# EAGLE design Reef Controller rev2 (EAGLE 7.4.0)
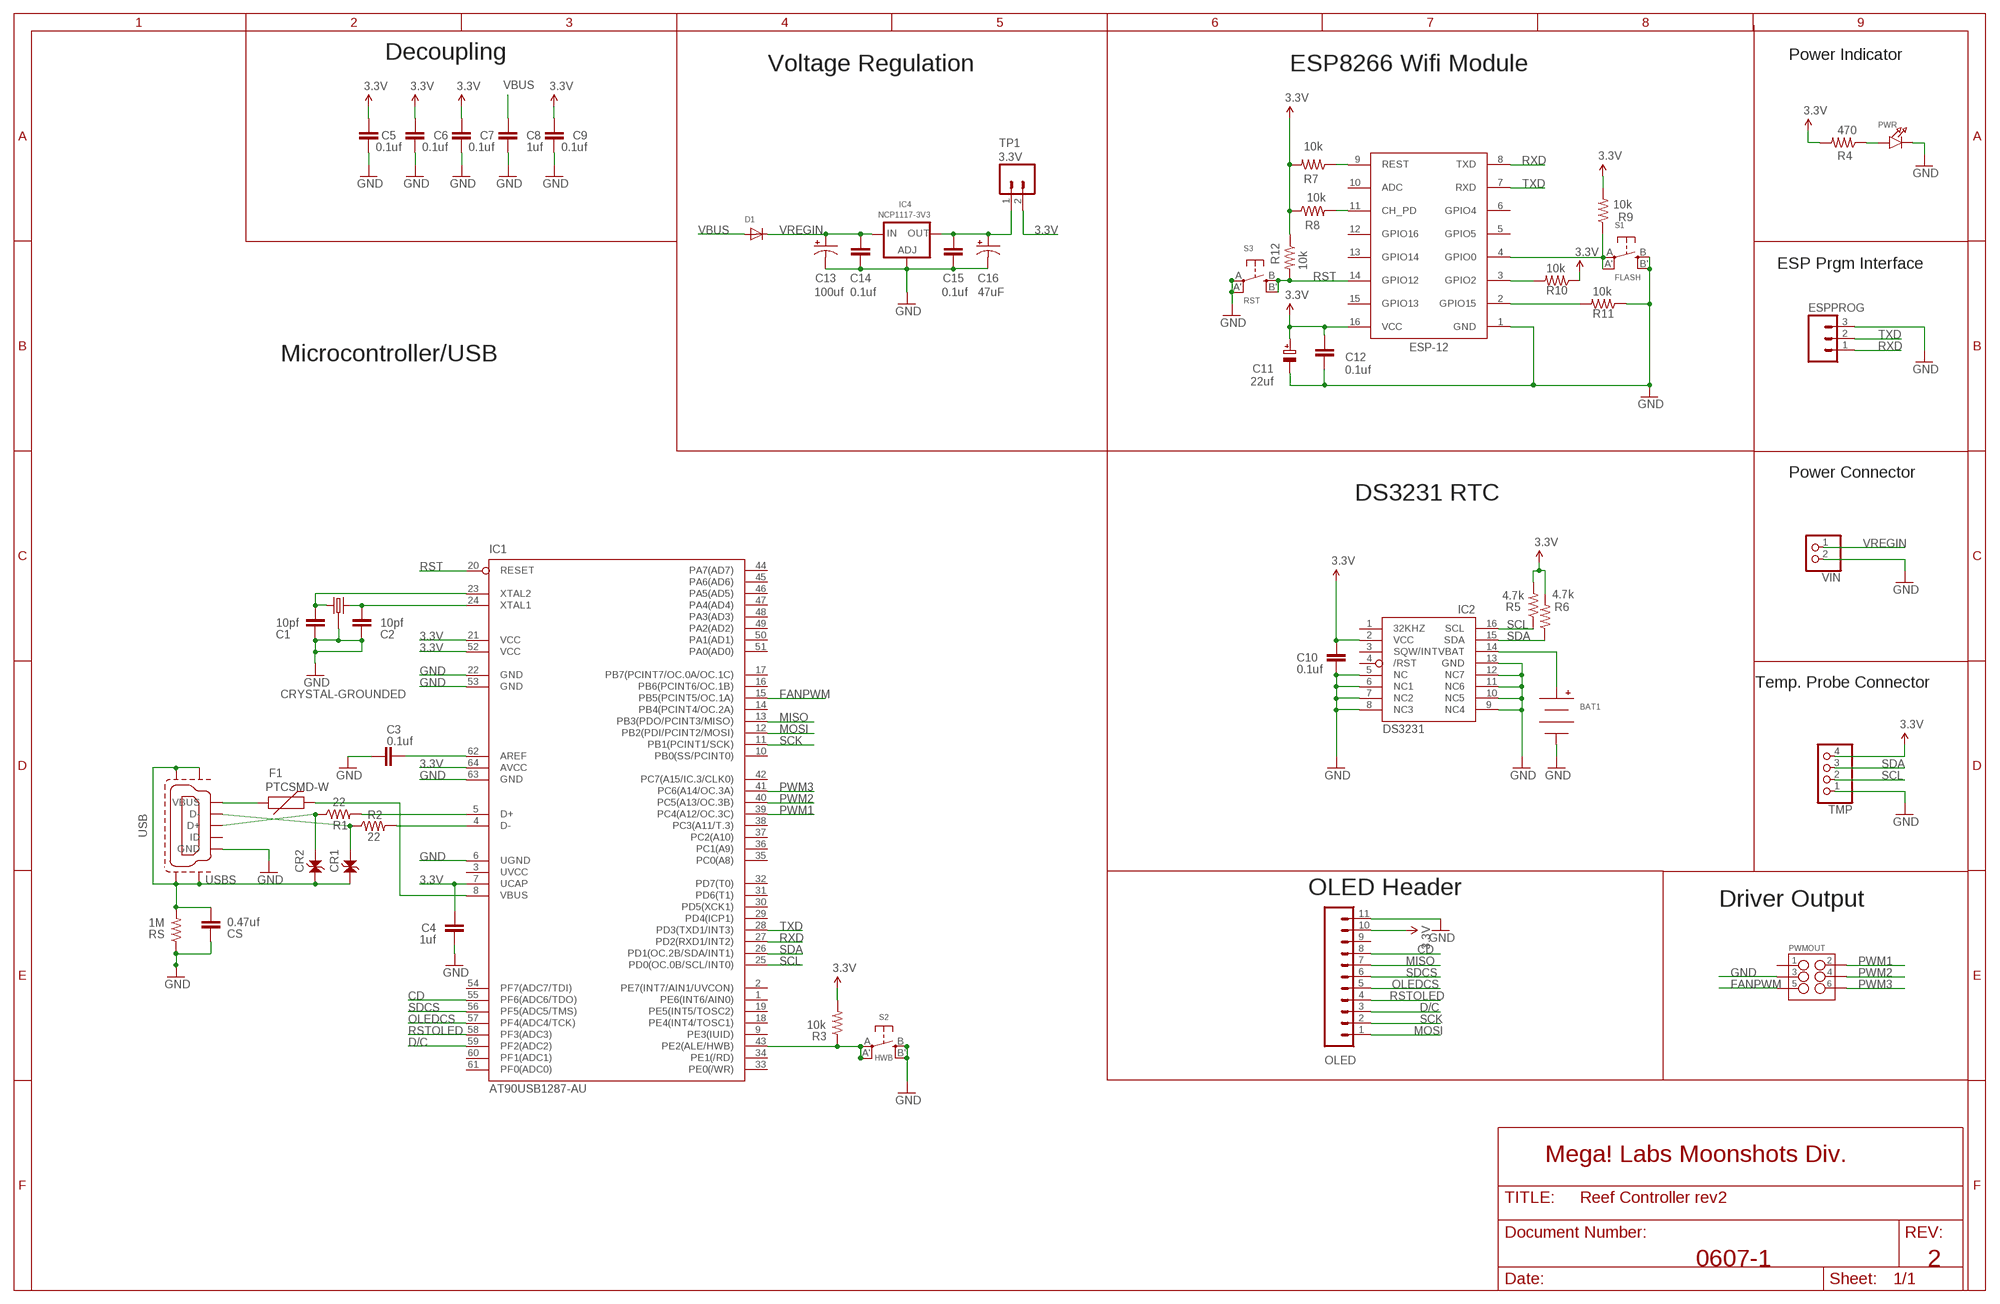
[diagram p0: schematic, sheet 1]

## Parts
BAT1  BHX1-2032-SM  [BHX1-2032-SM]
C1  10pf  CAP0805  [0805]
C2  10pf  CAP0805  [0805]
C3  0.1uf  CAP0805  [0805]
C4  1uf  CAP0805  [0805]
C5  0.1uf  CAP0805  [0805]
C6  0.1uf  CAP0805  [0805]
C7  0.1uf  CAP0805  [0805]
C8  1uf  CAP0805  [0805]
C9  0.1uf  CAP0805  [0805]
C10  0.1uf  CAP0805  [0805]
C11  22uf  CAP_TANTALUMA/3216_REFLOW  [EIA3216-18/A-R]
C12  0.1uf  CAP0805  [0805]
C13  100uf  47UF-50V-20%(ELECT)  [PANASONIC_D]
C14  0.1uf  CAP0805  [0805]
C15  0.1uf  CAP0805  [0805]
C16  47uF  47UF-10V-10%(TANT)  [EIA3528]
CR1  PGB1010603  [PGB1010603]
CR2  PGB1010603  [PGB1010603]
CS  0.47uf  CAP0805  [0805]
D1  DIODESOD-323F  [SOD-323F]
ESPPROG  M03PTH  [1X03]
F1  PTCSMD-W  [PTC-1206-WIDE]
IC1  AT90USB1287-AU  [TQFP64]
IC2  DS3231/SO  [SO16W]
IC3  ESP-12  [ESP-12]
IC4  NCP1117-3V3  LM1117TO252  [TO252]
OLED  M11PTH  [1X11]
PWMOUT  M03X2SHROUD  [2X3-SHROUDED]
PWR  LED0805_NOOUTLINE  [CHIPLED_0805_NOOUTLINE]
R1  22  RESISTOR0805-RES  [0805]
R2  22  RESISTOR0805-RES  [0805]
R3  10k  RESISTOR0805-RES  [0805]
R4  470  RESISTOR0805-RES  [0805]
R5  4.7k  RESISTOR0805-RES  [0805]
R6  4.7k  RESISTOR0805-RES  [0805]
R7  10k  RESISTOR0805-RES  [0805]
R8  10k  RESISTOR0805-RES  [0805]
R9  10k  RESISTOR0805-RES  [0805]
R10  10k  RESISTOR0805-RES  [0805]
R11  10k  RESISTOR0805-RES  [0805]
R12  10k  RESISTOR0805-RES  [0805]
RS  1M  RESISTOR0805-RES  [0805]
S1  FLASH  SWITCH_TACT_SMT4.6X2.8  [BTN_KMR2_4.6X2.8]
S2  HWB  SWITCH_TACT_SMT4.6X2.8  [BTN_KMR2_4.6X2.8]
S3  RST  SWITCH_TACT_SMT4.6X2.8  [BTN_KMR2_4.6X2.8]
TMP  JST_4PIN  [JSTPH4]
TP1  3.3V  M02PTH  [1X02]
USB  MINI-USB-SHIELD-UX60-MB-5ST  [UX60-MB-5ST]
VIN  JST_2PIN-SMT-RA  [JST-PH-2-SMT-RA]
X1  CRYSTAL-GROUNDED  [CRYSTAL-SMD-5X3]

## Nets
3.3V: C4.2 C5.1 C6.1 C7.1 C9.1 C10.1 C11.+ C12.2 IC1.7(UCAP) IC1.21(VCC) IC1.52(VCC) IC1.64(AVCC) IC2.2(VCC) IC3.16(VCC) OLED.10 R3.2 R4.2 R5.2 R6.2 R7.2 R8.1 R9.2 R10.1 R12.1 TMP.4 TP1.2
CD: IC1.55(PF6(ADC6/TDO)) OLED.8
D/C: IC1.59(PF2(ADC2)) OLED.3
D_N [usb]: CR1.2 R2.1 USB.D-
D_N2 [usb2]: IC1.4(D-) R2.2
D_P [usb]: CR2.2 R1.1 USB.D+
D_P2 [usb2]: IC1.5(D+) R1.2
FANPWM: IC1.15(PB5(PCINT5/OC.1A)) PWMOUT.5
GND: BAT1.2(NEG) C1.2 C2.2 C3.1 C4.1 C5.2 C6.2 C7.2 C8.2 C9.2 C10.2 C11.- C12.1 C13.- C14.2 C15.2 C16.C(-) CS.1 ESPPROG.3 IC1.6(UGND) IC1.22(GND) IC1.53(GND) IC1.63(GND) IC2.5(NC) IC2.6(NC1) IC2.7(NC2) IC2.8(NC3) IC2.9(NC4) IC2.10(NC5) IC2.11(NC6) IC2.12(NC7) IC2.13(GND) IC3.1(GND) IC4.1(ADJ) OLED.11 PWMOUT.3 PWR.C R11.1 RS.1 S1.B'(S1) S1.B(S) S2.B'(S1) S2.B(S) S3.A'(P1) S3.A(P) TMP.1 USB.GND VIN.2 X1.2 X1.4
MISO: IC1.13(PB3(PDO/PCINT3/MISO)) OLED.7
MOSI: IC1.12(PB2(PDI/PCINT2/MOSI)) OLED.1
N$2: IC1.43(PE2(ALE/HWB)) R3.1 S2.A'(P1) S2.A(P)
N$3: IC3.3(GPIO2) R10.2
N$4: IC3.4(GPIO0) R9.1 S1.A'(P1) S1.A(P)
N$6: CR1.1 CR2.1 CS.2 RS.2 USB.M1(M3) USB.M2 USB.M3(M4) USB.M4(M1)
N$8: PWR.A R4.1
N$9: BAT1.1(POS) IC2.14(VBAT)
N$10: C3.2 IC1.62(AREF)
N$11: IC3.11(CH_PD) R8.2
N$12: F1.1 USB.VBUS
N$14: IC3.2(GPIO15) R11.2
N$17: IC3.9(REST) R7.1
N$21: C15.1 C16.A(+) IC4.3(OUT) TP1.1
OLEDCS: IC1.57(PF4(ADC4/TCK)) OLED.5
PWM1: IC1.39(PC4(A12/OC.3C)) PWMOUT.2
PWM2: IC1.40(PC5(A13/OC.3B)) PWMOUT.4
PWM3: IC1.41(PC6(A14/OC.3A)) PWMOUT.6
RST: IC1.20(RESET) IC3.14(GPIO12) R12.2 S3.B'(S1) S3.B(S)
RSTOLED: IC1.58(PF3(ADC3)) OLED.4
RXD: ESPPROG.1 IC1.27(PD2(RXD1/INT2)) IC3.8(TXD)
SCK: IC1.11(PB1(PCINT1/SCK)) OLED.2
SCL: IC1.25(PD0(OC.0B/SCL/INT0)) IC2.16(SCL) R5.1 TMP.2
SDA: IC1.26(PD1(OC.2B/SDA/INT1)) IC2.15(SDA) R6.1 TMP.3
SDCS: IC1.56(PF5(ADC5/TMS)) OLED.6
TXD: ESPPROG.2 IC1.28(PD3(TXD1/INT3)) IC3.7(RXD)
VBUS: C8.1 D1.A F1.2 IC1.8(VBUS)
VREGIN: C13.+ C14.1 D1.C IC4.2(IN) VIN.1
XTAL_N [xtal]: C1.1 IC1.23(XTAL2) X1.3
XTAL_P [xtal]: C2.1 IC1.24(XTAL1) X1.1
Unconnected: IC1.1(PE6(INT6/AIN0)) IC1.2(PE7(INT7/AIN1/UVCON)) IC1.9(PE3(IUID)) IC1.10(PB0(SS/PCINT0)) IC1.14(PB4(PCINT4/OC.2A)) IC1.16(PB6(PCINT6/OC.1B)) IC1.17(PB7(PCINT7/OC.0A/OC.1C)) IC1.18(PE4(INT4/TOSC1)) IC1.19(PE5(INT5/TOSC2)) IC1.29(PD4(ICP1)) IC1.30(PD5(XCK1)) IC1.31(PD6(T1)) IC1.32(PD7(T0)) IC1.33(PE0(/WR)) IC1.34(PE1(/RD)) IC1.35(PC0(A8)) IC1.36(PC1(A9)) IC1.37(PC2(A10)) IC1.38(PC3(A11/T.3)) IC1.42(PC7(A15/IC.3/CLK0)) IC1.44(PA7(AD7)) IC1.45(PA6(AD6)) IC1.46(PA5(AD5)) IC1.47(PA4(AD4)) IC1.48(PA3(AD3)) IC1.49(PA2(AD2)) IC1.50(PA1(AD1)) IC1.51(PA0(AD0)) IC1.54(PF7(ADC7/TDI)) IC1.60(PF1(ADC1)) IC1.61(PF0(ADC0)) IC2.1(32KHZ) IC2.3(SQW/INT) IC2.4(/RST) IC3.5(GPIO5) IC3.6(GPIO4) IC3.10(ADC) IC3.12(GPIO16) IC3.13(GPIO14) IC3.15(GPIO13) OLED.9 PWMOUT.1 USB.ID

## Notes on the sheet
- Decoupling | Power Indicator
- Voltage Regulation | ESP8266 Wifi Module
- ESP Prgm Interface
- Microcontroller/USB
- Power Connector
- DS3231 RTC
- Temp. Probe Connector
- OLED Header
- Driver Output
- Mega! Labs Moonshots Div.
- 0607-1 | 2

## Power pins joined to a net without a drawn wire
UVCC: IC1.3(UVCC)

## Library data of the parts
BAT1 = battery-holder:BHX1-2032-SM: Description: BHX1-2032-SM Batt holder for CR2032 cell SMD, Glide insert Digi-Key BHX1-2032-SM <http://www.digikey.com/product-detail/en/BHX1-2032-SM/BHX1-2032-SM-ND/2194761>
C1-C10 C12 C14 C15 CS = SparkFun-Passives:CAP: Capacitor Standard 0603 ceramic capacitor, and 0.1" leaded capacitor.
C11 = microbuilder:CAP_TANTALUM: Tantalum Capacitors Wave footprints have larger pads and are meant to be used for hand soldering. Reflow footprints are optimised for solder paste and a reflow oven. EIA3216-18/A-[R/W] - Size A / 3216-18 / 1206 footprint 4.7µF 25V 10% Tantalum Capacitor 10µF 16V 10% Tantalum Capacitor [Digikey: 495-2236-2-ND] EIA3528-21/B-[R/W] - Size B / 3528-21 47µF 10V 10% Tantalum Capactior [Digikey: 495-2216-1-ND] EIA6032-28/C-[R/W] - Size C / 6032-28 10µF 35V 20% Tantalum Capacitor [Digikey: 495-2285-1-ND] 100µF 16V 10% Tantalum Capactior [Digikey: 399-5214-1-ND]
C13 = SparkFun-Capacitors:47UF-50V-20%(ELECT): CAP-10547; PROD_ID: CAP-10547
C16 = SparkFun-Capacitors:47UF-10V-10%(TANT): CAP-08310 47uF Tantalum SMT 10V 10% (EIA-3528); PROD_ID: CAP-08310
CR1 CR2 = ESD:PGB1010603: Littlefuse ESD supressor
D1 = adafruit:DIODE: Diode SMADIODE - SMA Surface Mount Package 20V 1A Schottky Diode Digikey: 641-1014-6-ND DO-1N4148 - Through Hole Small Current Diode SOD-123 20V 1 A (.5mV Vf) Schottky Diode - Digikey: MBRX120TPMSCT-ND SOD-323 10V 570mA (.38mV Vf, 3ns) Schottky Diode - Digikey: ZLLS410CT-ND SOD-523 30V 30mA Schottky Diode (RB751S-40TE61) - Digikey: RB751S-40TE61CT-ND SOT23-R/W - SOT23 Package (R = Solder Paste/Reflow Ovens, W = Hand-Soldering) BAT54Film 40V 300mA - Digikey: 497-7162-1-ND
ESPPROG = SparkFun-Connectors:M03: Header 3 Standard 3-pin 0.1" header. Use with straight break away headers (SKU : PRT-00116), right angle break away headers (PRT-00553), swiss pins (PRT-00743), machine pins (PRT-00117), and female headers (PRT-00115). Molex polarized connector foot print use with SKU : PRT-08232 with associated crimp pins and housings.
F1 = SparkFun-PowerIC:PTC: Resettable Fuse PTC Resettable Fuse. Spark Fun Electronics SKU : COM-08357
IC1 = at90usb:AT90USB1287-*: Atmel AT90USB1287 AVR Microcontroller with USB Interface and 128kB Flash Memory
IC2 = adafruit:DS3231
IC3 = ESP8266-12:ESP-12
IC4 = microbuilder:LM1117: LM1117 Voltage Regulator LM1117 Adjustable Voltage regulator [Digikey: LM1117IMP-ADJDKR-ND] LM1117 3.3V Voltage regulator [AP1117E33GDIDKR-ND] LM1117 5.0V Voltage regulator [AP1117E50GDIDKR-ND] SOT223-REFLOW - SOT223 package for solder paste/reflow ovens SOT223-WAVE - SOT223 package for hand-soldering (larger pads) Note: For the fixed-voltage regulators, simply set the ADJ pin to GND.
OLED = SparkFun-Connectors:M11: Header 11 Standard 11-pin 0.1" header. Use with straight break away headers (SKU : PRT-00116), right angle break away headers (PRT-00553), swiss pins (PRT-00743), machine pins (PRT-00117), and female headers (PRT-00115).
PWMOUT = SparkFun-Connectors:M03X2: 2x3 .1" header. Shrouded, with keying- CONN-10681 SMT- CONN-11415 Pogo pins- HW-11044; PROD_ID: CONN-10681
PWR = microbuilder:LED: LED 0603 - 0603 Surface Mount Package 2mA: Green LED - Low Power (3.9mcd, 2ma, 1.7Vf) - Digikey: 475-2709-2-ND Orange LED - Low Power (9.8mcd, 2ma, 1.8Vf) - Digikey: 475-1194-2-ND Red LED - Low Power (5mcd, 2ma, 1.8Vf) - Digikey: 475-1195-2-ND Yellow LED - Low Power (7mcd, 2ma, 1.8Vf) - Digikey: 475-1196-2-ND 5mA: Blue LED - Low Power (17mcd, 5ma, 2.9Vf) - Digikey: LNJ937W8CRACT-ND 0805 - 0805 Surface Mount Package 2mA: Red LED (8.8mcd, 2mA, 1.8Vf, Clear) - Low Power [Digikey: 475-2510-1-ND] Green LED (5mcd, 2mA, 1.8Vf, Clear) - Low Power [Digikey: 475-2730-1-ND] Yellow LED (11.3mcd, 2mA, 1.8Vf, Clear) - Low Power [Digikey: 475-2555-1-ND] 20mA: Red LED (104mcd, 20mA, Diffused) - LS R976 [Digikey: 475-1278-6-ND] Red LED (12mcd, 20mA, 2.0Vf, Clear) - APT2012EC [Digikey: 754-1128-1-ND] Green LED (15mcd, 20mA, 2.2Vf, Clear) - APT2012GC [Digikey: 754-1131-1-ND] Orange LED (160mcd, 20mA, 2.1Vf, Clear) - APT2012SECK [Digikey: 754-1130-1-ND] 1206 - 1206 Surface Mount Package Green LED (26mcd, 20mA, Diffused) - LG N971 [Digikey: 475-1407-6-ND] Red LED (15mcd, 20mA, Diffused) - LH N974 [Digikey: 475-1416-6-ND]
R1-R12 RS = SparkFun-Passives:RESISTOR: Resistor Basic schematic elements and footprints for 0603, 1206, and PTH resistors.
S1-S3 = microbuilder:SWITCH_TACT_SMT: SMT Tact Switches 6x6mm - Digikey: P12940SCT-ND KMR2 (4.6x2.8mm) - Digikey: 401-1426-1-ND EVQ-PQHB55 - Light Touch, 160GF (4.5x4.5mm) - Digikey: P8090SCT-ND
TMP = microbuilder:JST_4PIN: JST 4-Pin Right-Angle Connector 4UConnector: 17312
TP1 = SparkFun-Connectors:M02: Standard 2-pin 0.1" header. Use with - straight break away headers ( PRT-00116) - right angle break away headers (PRT-00553) - swiss pins (PRT-00743) - machine pins (PRT-00117) - female headers (PRT-00115) Molex polarized connector foot print use with: PRT-08233 with associated crimp pins and housings. 2.54_SCREWTERM for use with PRT-10571. 3.5mm Screw Terminal footprints for PRT-08084 5mm Screw Terminal footprints for use with PRT-08432
USB = con-hirose:MINI-USB-SHIELD-: MINI USB Connector Source: http://www.hirose.co.jp/cataloge_hp/e24000019.pdf; OC_FARNELL: unknown; OC_NEWARK: unknown
VIN = adafruit:JST_2PIN: JST 2-Pin Connectors of various flavors SMT-RA (S2B-PH-SM4) 4UConnector #17311 SMT (B2B-PH-SM4) THM-RA (S2B-PH) THM (B2B-PH)
X1 = SparkFun-FreqCtrl:CRYSTAL-GROUNDED

## Net classes
1 xtal: width 0.305 mm, clearance 0.152 mm
2 usb: width 0.406 mm, clearance 0.152 mm
3 usb2: width 0.406 mm, clearance 0.152 mm

## Board
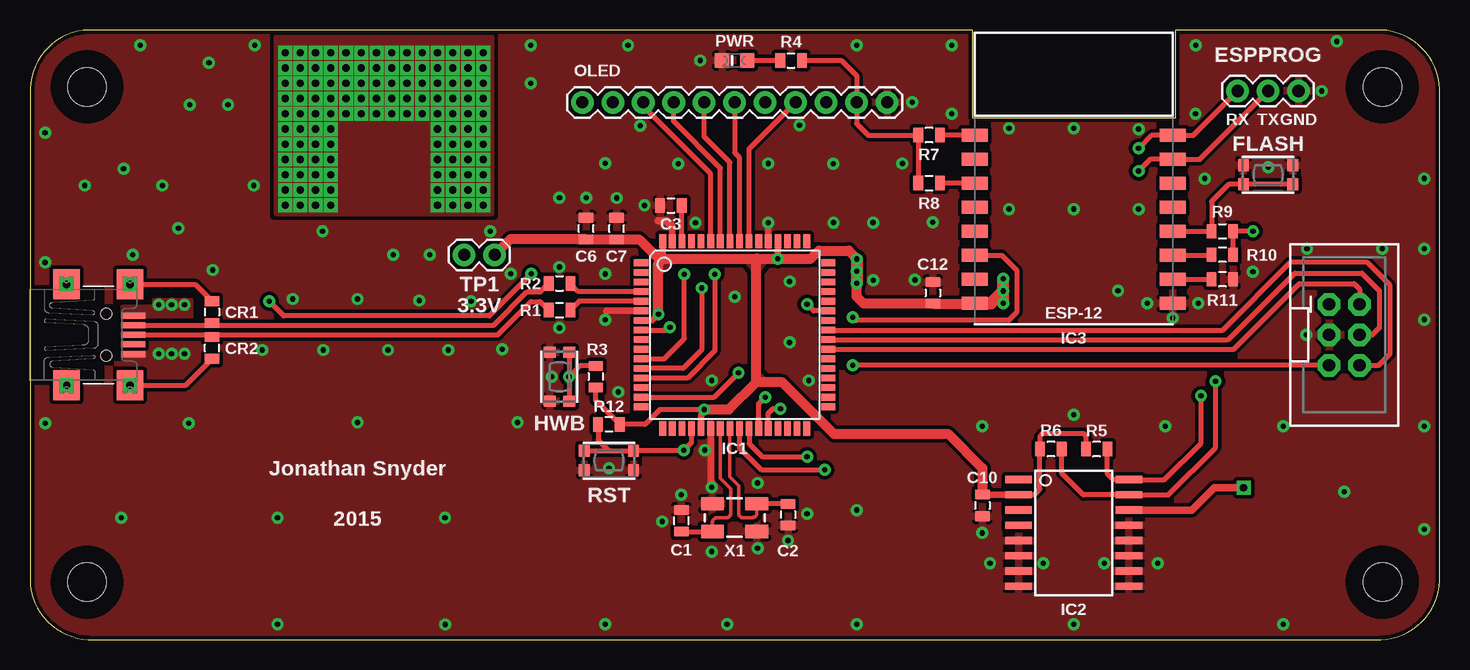
[diagram p1: board, top side]
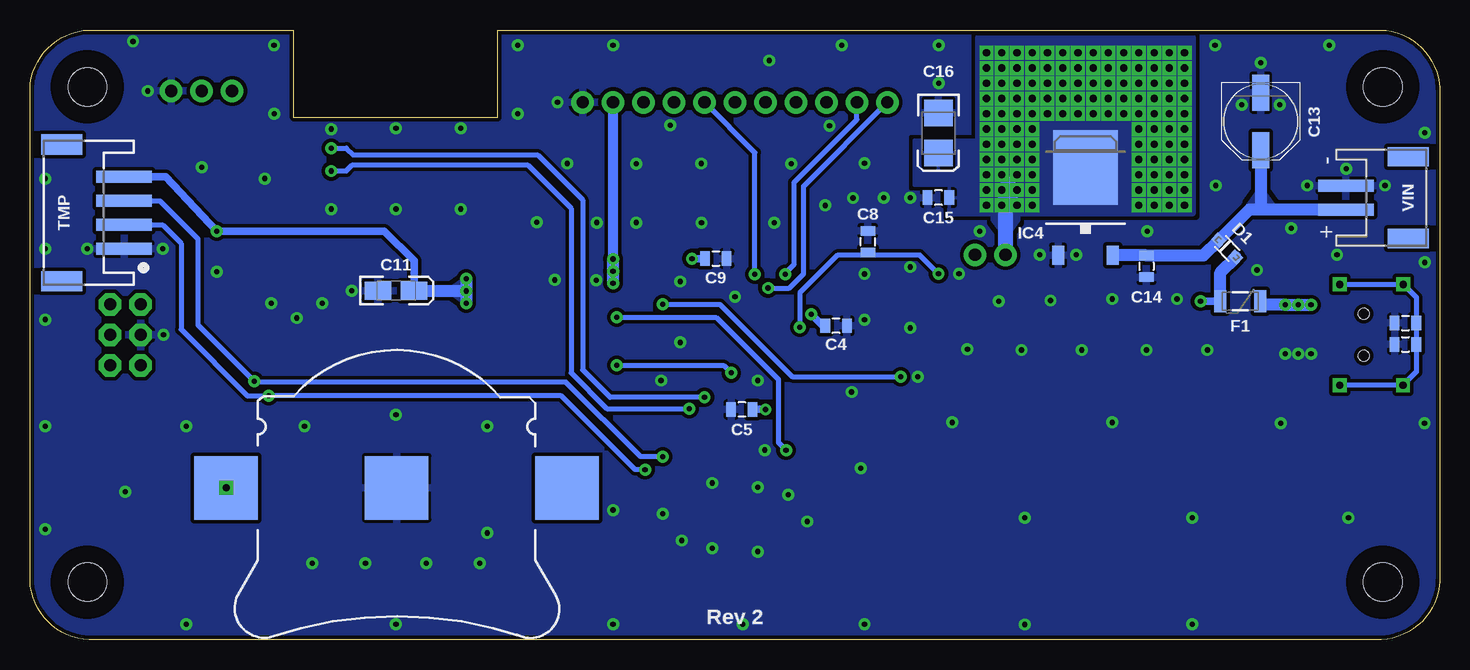
[diagram p2: board, bottom side, seen from below]

Size 117.48 x 50.8 mm. Coordinates in mm from the lower left corner, seen from the top.
Outline: 112.55,0 4.86,0 arc-86 0,4.92 0,45.93 arc-86 4.92,50.8
Outline: 112.55,0 112.55,0
Outline: 117.47,4.9 117.47,4.9
Outline: 117.47,4.9 117.47,45.87 arc86 112.57,50.8 95.49,50.8 95.49,43.5 78.54,43.5 78.54,50.8 4.92,50.8
Outline: 4.92,50.8 4.92,50.8
Outline: 112.55,0 arc86 117.47,4.9
Copper layers (1*16): Top 0.0356mm / dielectric 1.5011mm / Bottom 0.0356mm
Design rules "Jon's mod drc": minimum track width 6mil, minimum drill 13mil, track to track 6mil, track to pad 6mil, pad to pad 6mil, via to via 6mil, smd to smd 6mil, copper to edge 13mil, drill to drill 6mil, minimum pad ring 7mil, minimum via ring 11mil, stop-mask expansion 3mil, vias tented up to drill 1.3mm, thermal gap 10mil
Holes 3.2 mm at 4.75,46.06 112.7,46.06 112.7,4.79 4.75,4.79
tRestrict: area 2.5,43.8 to 7,48.3; area 2.5,2.6 to 7,7; area 110.5,2.6 to 114.9,7; area 110.5,43.8 to 114.9,48.3
bRestrict: area 2.5,43.8 to 7,48.3; area 110.5,43.8 to 114.9,48.3; area 110.5,2.6 to 114.9,7; area 2.5,2.6 to 7,7

### Footprints (pad centres in the part's own frame; a part is rotated, then mirrored left to right if it is on the bottom)
BHX1-2032-SM = smd 5.3 x 5.3: 1 -14.15,-0.05; 2 0.06,-0.05; 3 14.248,-0.05
0805 = smd 0.8 x 1.2: 1 -0.9,0; 2 0.9,0
EIA3216-18/A-R = smd 2.2 x 1.5: + 1.515,0; - -1.508,0
PANASONIC_D = smd 3 x 1.4: + 2.4,0; - -2.4,0
EIA3528 = smd 2.21 x 2.35: A 1.675,0; C -1.666,0
PGB1010603 = smd 0.8 x 1.2: 1 -0.9,0; 2 0.9,0
SOD-323F = smd 1 x 0.8: A -1,0; C 1,0
1X03 = drill 1.016 pad 1.88: 1 0,0; 2 2.54,0; 3 5.08,0
PTC-1206-WIDE = smd 1 x 1.8: 1 -1.654,0; 2 1.654,0
TQFP64 = smd 1.194 x 0.559: 1 -7.8,6; 2 -7.8,5.2; 3 -7.8,4.4; 4 -7.8,3.6; 5 -7.8,2.8; 6 -7.8,2; 7 -7.8,1.2; 8 -7.8,0.4; 9 -7.8,-0.4; 10 -7.8,-1.2; 11 -7.8,-2; 12 -7.8,-2.8; 13 -7.8,-3.6; 14 -7.8,-4.4; 15 -7.8,-5.2; 16 -7.8,-6; 33 7.8,-6; 34 7.8,-5.2; 35 7.8,-4.4; 36 7.8,-3.6; 37 7.8,-2.8; 38 7.8,-2; 39 7.8,-1.2; 40 7.8,-0.4; 41 7.8,0.4; 42 7.8,1.2; 43 7.8,2; 44 7.8,2.8; 45 7.8,3.6; 46 7.8,4.4; 47 7.8,5.2; 48 7.8,6 | smd 0.559 x 1.194: 17 -6,-7.8; 18 -5.2,-7.8; 19 -4.4,-7.8; 20 -3.6,-7.8; 21 -2.8,-7.8; 22 -2,-7.8; 23 -1.2,-7.8; 24 -0.4,-7.8; 25 0.4,-7.8; 26 1.2,-7.8; 27 2,-7.8; 28 2.8,-7.8; 29 3.6,-7.8; 30 4.4,-7.8; 31 5.2,-7.8; 32 6,-7.8; 49 6,7.8; 50 5.2,7.8; 51 4.4,7.8; 52 3.6,7.8; 53 2.8,7.8; 54 2,7.8; 55 1.2,7.8; 56 0.4,7.8; 57 -0.4,7.8; 58 -1.2,7.8; 59 -2,7.8; 60 -2.8,7.8; 61 -3.6,7.8; 62 -4.4,7.8; 63 -5.2,7.8; 64 -6,7.8
SO16W = smd 0.6 x 2.2: 1 -4.445,-4.6; 2 -3.175,-4.6; 3 -1.905,-4.6; 4 -0.635,-4.6; 5 0.635,-4.6; 6 1.905,-4.6; 7 3.175,-4.6; 8 4.445,-4.6; 9 4.445,4.6; 10 3.175,4.6; 11 1.905,4.6; 12 0.635,4.6; 13 -0.635,4.6; 14 -1.905,4.6; 15 -3.175,4.6; 16 -4.445,4.6
ESP-12 = smd 2.184 x 1.067: 1 8.244,-6.963; 2 8.244,-4.963; 3 8.244,-2.963; 4 8.244,-0.963; 5 8.244,1.037; 6 8.244,3.037; 7 8.244,5.037; 8 8.244,7.037; 9 -8.256,7.037; 10 -8.256,5.037; 11 -8.256,3.037; 12 -8.256,1.037; 13 -8.256,-0.963; 14 -8.256,-2.963; 15 -8.256,-4.963; 16 -8.256,-6.963
TO252 = smd 1 x 1.6: 1 -2.28,-4.8; 2 2.28,-4.8 | smd 5.4 x 6.2: 3 0,2.5
1X11 = drill 1.016 pad 1.88: 1 0,0; 2 2.54,0; 3 5.08,0; 4 7.62,0; 5 10.16,0; 6 12.7,0; 7 15.24,0; 8 17.78,0; 9 20.32,0; 10 22.86,0; 11 25.4,0
2X3-SHROUDED = drill 1.016 pad 1.88 octagon: 1 -1.27,2.54; 2 1.27,2.54; 3 -1.27,0; 4 1.27,0; 5 -1.27,-2.54; 6 1.27,-2.54
CHIPLED_0805_NOOUTLINE = smd 1.2 x 1.2: A 0,-1.05; C 0,1.05
BTN_KMR2_4.6X2.8 = smd 0.9 x 1: A 2.05,0.8; A' -2.05,0.8; B 2.05,-0.8; B' -2.05,-0.8
JSTPH4 = smd 1 x 4.6: 1 -3,-3.7; 2 -1,-3.7; 3 1,-3.7; 4 3,-3.7 | smd 1.7 x 3.4: NC1 -5.7,1.5; NC2 5.7,1.5
1X02 = drill 1.016 pad 1.88: 1 0,0; 2 2.54,0
UX60-MB-5ST = smd 2 x 0.5: D+ 2.25,0; D- 2.25,0.8; GND 2.25,-1.6; ID 2.25,-0.8; VBUS 2.25,1.6 | smd 2.2 x 2.5: M1 -3.3,-4.2; M2 -3.3,4.2; M3 2,4.2; M4 2,-4.2 | hole 0.9: 0,-1.75; 0,1.75
JST-PH-2-SMT-RA = smd 1 x 4.6: 1 1,-3.7; 2 -1,-3.7 | smd 1.6 x 3.4: NC1 -3.4,1.5; NC2 3.4,1.5
CRYSTAL-SMD-5X3 = smd 1.9 x 1.1: 1 -1.85,-1.15; 2 1.85,-1.15; 3 1.85,1.15; 4 -1.85,1.15

### Placement (x,y rotation side)
BAT1  86.98,12.7 0 bottom
C1  54.28,9.91 90 top
C2  63.17,10.41 270 top
C3  53.41,36.18 0 top
C4  50.3,26.16 180 bottom
C5  58.15,19.18 180 bottom
C6  46.34,34.26 90 top
C7  48.88,34.26 90 top
C8  47.65,33.16 90 bottom
C9  60.32,31.76 0 bottom
C10  79.36,11.18 270 top
C11  86.98,29.08 0 bottom
C12  75.23,28.89 270 top
C13  14.91,43.18 270 bottom
C14  24.43,31.11 270 bottom
C15  41.77,36.83 180 bottom
C16  41.77,42.23 270 bottom
CR1  15.17,27.3 270 top
CR2  15.17,24.3 90 top
CS  2.85,26.38 0 bottom
D1  17.7,32.58 135 bottom
ESPPROG  100.63,45.72 0 top
F1  16.62,28.19 180 bottom
IC1  58.72,25.4 0 top
IC2  86.98,8.89 270 top
IC3  86.98,34.99 0 top
IC4  29.51,36.83 0 bottom
OLED  46.02,44.77 0 top
PWMOUT  109.52,25.4 0 top
PWR  58.72,48.26 90 top
R1  44.13,27.46 0 top
R2  44.13,29.68 0 top
R3  47.14,21.91 270 top
R4  63.42,48.26 0 top
R5  88.89,15.88 180 top
R6  85.08,15.88 180 top
R7  74.92,42.04 180 top
R8  74.92,38.04 0 top
R9  99.36,34.03 0 top
R10  99.36,32.07 180 top
R11  99.36,30.03 180 top
R12  48.25,17.94 180 top
RS  2.85,24.61 0 bottom
S1  103.17,38.73 180 top
S2  44.12,21.91 270 top
S3  48.25,14.92 180 top
TMP  113.33,35.56 90 bottom
TP1  36.18,32.07 0 top
U$1  [OSHW-LOGO-L_COPPER]  109.52,12.32 0 top
USB  6.34,25.4 0 top
VIN  4.11,36.83 270 bottom
X1  58.72,10.16 180 top

### Tracks (layer width: path | path; a pad name or v marks a point on that pad's centre or on a via)
3.3V  (via drill 0.43)
  Top 0.305: IC1.7 | IC1.7 | IC1.7 | C12.2 75.23,28
  Top 0.406: v101.92,34.03 R9.2 R10.1 | IC1.7 50.9,26.57 | IC1.52 | IC2.2 83.68,12.07 84.16,12.54 84.16,15.85 R6.2 84.18,16.94 84.41,17.18 87.78,17.18 88,16.95 88,15.89 R5.2 | R4.2 67.61,48.26 68.88,46.99 OLED.10 68.88,42.99 69.84,42.04 R7.2 R8.1 | 56.16,19.2 v56.18,19.18 52.5,19.18 51.26,17.94 R12.1 47.14,19.94 R3.2 | C12.2
  Top 0.559: 56.37,19.18 55.92,18.73 IC1.21 | IC1.64 52.72,31.75 | IC1.7 51.86,26.6 v52.37,27.11 | 62.32,31.92 IC1.52 | C10.1 82.37,12.08 IC2.2
  Top 0.61: 60.5,31.69 60.57,31.75 | 62.32,31.76 v62.31,31.75 | 62.32,31.92 62.15,31.75 | 82.05,12.08 IC2.2
  Top 0.813: v56.18,19.18 56.37,19.18 58.25,19.18 60.5,21.43 | 60.5,21.43 60.5,31.69 | v52.37,27.11 52.37,31.4 52.55,31.57 | 52.55,31.57 52.72,31.75 60.57,31.75 62.15,31.75 v62.31,31.75 65.07,31.75 65.74,32.42 68.25,32.42 v68.88,31.72 68.88,31.75 | 52.55,31.57 50.77,33.36 C7.1 C6.1 40.01,33.36 TP1.2 | C10.1 79.36,14.29 76.5,17.14 66.98,17.14 62.69,21.43 60.5,21.43 | C12.2 78.69,27.99 IC3.16 | C12.2 69.47,27.99 68.88,28.57 v68.88,29.69
  Top 1.016: v81.11,28.04 v81.11,29.05 | v81.11,29.05 v81.11,30.07 | IC3.16 80.08,28.03 v81.11,29.05 | v68.88,31.72 v68.88,30.7 v68.88,29.69
  Bottom 0.61: TMP.4 106.17,38.56 v101.92,34.03 | C5.1 v56.18,19.18 | C9.1 v62.31,31.75 | C4.2 51.42,26.16 v52.37,27.11 | v101.92,34.04 v101.92,34.03 | C11.+ 85.47,31.55 87.95,34.03 v101.92,34.03
  Bottom 0.813: v68.88,29.69 OLED.10 | 81.14,29.08 v81.11,29.05
  Bottom 1.016: v81.11,30.07 v81.11,29.05 v81.11,28.04 | v68.88,29.69 v68.88,31.72 | C11.+ 81.14,29.08
  pour Top: 59.55,31.75 60.5,30.48 61.46,31.75
  pour Top: 60.45,21.3 61.53,21.33 60.48,22.44
  pour Bottom: 81.12,30.16 82.64,29.08 81.12,28.01
  pour Top: 53.86,31.84 52.17,32 52.33,30.32
CD
  Top 0.406: IC1.55 59.92,40.89 OLED.8
D/C
  Top 0.406: OLED.3 51.1,44.45 56.72,38.83 IC1.59
D_N
  Top 0.406: USB.D- 15.54,26.2 | 15.54,26.2 38.63,26.2 41.41,28.98 42.53,28.98 R2.1 | CR1.2 15.35,26.4 15.54,26.2
D_N2
  Top 0.406: IC1.4 45.71,29 R2.2
D_P
  Top 0.406: USB.D+ 14.91,25.4 | 14.91,25.4 38.98,25.4 41.75,28.17 42.52,28.17 R1.1 | CR2.2 14.91,25.2 14.91,25.4
D_P2
  Top 0.406: IC1.5 45.77,28.2 R1.2
FANPWM  (via drill 0.43)
  Top 0.406: PWMOUT.5 v68.57,22.86 | IC1.15 57.02,20.2 v59.04,22.23
  Bottom 0.406: v68.57,22.86 59.68,22.86 v59.04,22.23
GND  (via drill 0.43)
  Top 0.305: USB.GND 7.96,23.8 7.94,23.81
  Top 0.406: 48.02,27.4 v47.93,26.66
  Top 0.559: IC1.22 56.72,12.79 | IC1.53 61.52,34.66 | IC1.6 48.02,27.4 | IC1.63 53.52,34.41
  Top 0.61: 56.41,15.88 v56.24,15.79 | 56.72,12.79 v56.82,12.7 | 53.52,34.41 53.01,34.92 52.37,34.92
  other vias: 73.74,29.97 79.36,17.78 10.72,23.81 27.29,28.38 30.28,32.07 33.32,32.07 46.34,36.81 41.74,46.35 55.87,48.26 40.63,18.1 58.09,1.27 79.36,8.89 80,6.35 84.44,6.35 89.52,6.35 93.97,6.35 93.11,28.04 97.36,28.04 101.91,30.65 97.14,49.53 103.17,39.37 106.35,25.4 32.44,28.26 14.91,48.07 11.04,37.85 7.8,39.24 4.56,37.85 116.19,32.58 106.41,32.58 1.26,18.03 24.43,24.13 29.83,24.13 34.85,24.13 47.93,1.27 49.83,49.53 41.74,49.53 18.72,49.53 81.58,35.88 86.98,35.88 107.65,45.72 116.19,38.42 116.19,17.78 104.44,1.27 104.44,17.78 94.6,17.78 68.88,1.27 68.88,49.53 76.82,49.53 73.52,44.77 116.19,9.21 18.66,37.85 47.93,39.69 9.19,49.53 1.26,31.43 97.13,43.81 95.24,26.8 34.59,1.26 48.89,36.8 92.38,35.88 81.58,42.61 86.98,42.61 66.95,39.66 90.67,29.08 97.9,38.42 86.98,18.73 54.28,12.07 63.17,8.26 60.63,13.05 60.63,7.62 56.82,7.33 61.52,34.73 92.38,42.54 76.82,43.81 7.61,10.16 16.5,44.58 13.32,44.58 49.01,20.64 1.26,42.23 15.23,30.8 12.37,34.29 21.89,28.38 40.06,30.48 51.21,36.18 19.35,24.13 36.75,28.19 63.3,29.84 63.3,24.77 52.69,9.84 64.76,10.48 11.8,23.81 12.88,23.81 64.13,42.85 61.53,39.67 58.72,28.57 56.82,21.59 66.95,34.75 44.12,36.83 55.45,34.73 54.03,39.66 8.56,32.07 72.7,39.67 20.62,10.16 20.62,1.27 13.24,18.03 116.19,26.67 112.7,32.58 86.98,1.27 68.88,10.79 109.52,12.32 34.58,10.14 27.29,18.1 108.89,49.85 70.28,29.94 39.36,24.19 75.23,34.77 64.88,21.59 47.93,30.47 44.12,31.05 44.12,25.97 70.26,34.75 48.25,14.29 24.37,34.04 38.34,34.04 50.85,42.83 43.48,21.91
  pour Top (isolate 0.305, rank 3): 0,50.8 0,0 117.48,0 117.48,50.8
  pour Bottom (isolate 0.305, rank 3): 0,50.8 0,0 117.48,0 117.48,50.8
  pour Top (no thermals): 10.53,22.91 7.71,22.91 7.71,23.99 10.53,23.99
MISO  (via drill 0.43)
  Top 0.305: IC1.13
  Top 0.406: v57.07,30.45 57.07,24.07 54.8,21.8 IC1.13 | IC1.13
  Bottom 0.406: v57.07,30.45 57.07,40.58 OLED.7
MOSI  (via drill 0.43)
  Top 0.406: v55.97,29.3 55.97,24.15 54.42,22.6 IC1.12 | IC1.12
  Bottom 0.406: OLED.1 53.01,37.78 53.01,30.48 54.19,29.3 v55.97,29.3
N$2  (via drill 0.43)
  Top 0.406: IC1.43 65.3,27.4 v64.76,27.94 | S2.A' v44.92,21.91 | v44.92,21.91 S2.A | R3.1 45.83,22.81 v44.92,21.91
  Bottom 0.406: v64.76,27.94 59.99,27.94 53.96,21.91 v44.92,21.91
N$3
  Top 0.406: IC3.3 98.42,32.02 R10.2
N$4
  Top 0.406: IC3.4 R9.1 98.48,34.04 98.48,36.51 99.9,37.93 S1.A S1.A'
N$6  (via drill 0.6)
  Top 0.305: USB.M3 | USB.M3 | USB.M2 | USB.M2
  Top 0.406: CR1.1 13.77,29.6 USB.M3 | USB.M1 v3.06,21.2 v3.06,21.21 | USB.M4 12.97,21.2 CR2.1
  Bottom 0.406: USB.M4 v3.06,21.2 v3.06,21.21 | USB.M3 USB.M2 1.95,28.51 CS.2 RS.2 1.95,22.32 v3.06,21.21 | USB.M1 v3.06,21.21
  other vias: 8.34,21.2 3.04,29.6 8.34,29.6
N$8
  Top 0.406: PWR.A R4.1
N$9  (via drill 0.6)
  Top 0.61: IC2.14 96.82,10.79 98.68,12.65 BAT1.1
  Bottom 0.61: BAT1.1 100.81,11.61 101.27,12.07
  other vias: 101.13,12.65
N$10
  Top 0.406: IC1.62 54.32,36.1 C3.2
N$11
  Top 0.406: IC3.11 75.83,38.02 R8.2
N$12  (via drill 0.43)
  Bottom 1.016: v10.72,27.91 v11.8,27.91 v12.88,27.91 14.68,27.91 F1.1
  pour Top (no thermals): 10.29,28.33 13.48,28.33 13.48,26.89 10.29,26.89
  pour Top (no thermals): 10.59,26.86 7.7,26.86 7.7,27.81 10.59,27.81
N$14
  Top 0.406: IC3.2 95.26,30.03 R11.2
N$17
  Top 0.406: IC3.9 75.83,42.02 R7.1
N$21  (via drill 0.6)
  Bottom 1.016: 36.12,37.84 35.86,38.1 | 36.13,36.56 v35.23,37.46 | 36.18,37.15 v36.5,37.46
  Bottom 1.27: TP1.1 36.18,37.15
  other vias: 27.61,43.81 28.88,43.81 30.15,43.81 31.42,43.81 32.69,43.81 33.96,43.81 33.96,42.54 33.96,41.27 33.96,40 33.96,38.73 33.96,37.46 33.96,36.2 36.5,36.2 35.23,36.2 35.23,38.73 35.23,40 35.23,41.27 35.23,42.54 35.23,43.81 36.5,43.81 36.5,38.73 36.5,40 36.5,41.27 36.5,42.54 26.34,43.81 25.07,43.81 23.8,43.81 22.53,43.81 22.53,45.08 22.53,46.35 23.8,46.35 25.07,46.35 26.34,46.35 27.61,46.35 27.61,45.08 26.34,45.08 25.07,45.08 23.8,45.08 22.53,36.2 23.8,36.2 25.07,36.2 25.07,37.46 25.07,38.73 25.07,40 25.07,41.27 25.07,42.54 23.8,42.54 22.53,42.54 23.8,41.27 22.53,41.27 22.53,40 23.8,40 23.8,38.73 22.53,38.73 22.53,37.46 23.8,37.46 36.5,45.08 35.23,45.08 33.96,45.08 32.69,45.08 31.42,45.08 30.15,45.08 28.88,45.08 28.88,46.35 30.15,46.35 31.42,46.35 32.69,46.35 33.96,46.35 35.23,46.35 36.5,46.35 22.53,47.62 22.53,48.89 23.8,47.62 23.8,48.89 25.07,47.62 25.07,48.89 26.34,47.62 26.34,48.89 27.61,47.62 27.61,48.89 28.88,47.62 28.88,48.89 30.15,47.62 30.15,48.89 31.42,47.62 31.42,48.89 32.69,47.62 32.69,48.89 33.96,47.62 33.96,48.89 35.23,47.62 35.23,48.89 36.5,47.62 36.5,48.89 21.26,48.89 21.26,47.62 21.26,46.35 21.26,45.08 21.26,43.81 21.26,42.54 21.26,41.27 21.26,40 21.26,38.73 21.26,37.46 21.26,36.2 37.77,36.2 37.77,37.46 37.77,38.73 37.77,40 37.77,41.27 37.77,42.54 37.77,43.81 37.77,45.08 37.77,46.35 37.77,47.62 37.77,48.89
  pour Top (isolate 0.406, no thermals): 20.62,35.56 38.4,35.56 38.4,50.16 20.62,50.16
  pour Bottom (isolate 0.406, no thermals): 20.62,35.56 38.4,35.56 38.4,50.16 20.62,50.16
  pour Bottom: 37.07,35.43 36.18,34.23 35.29,35.43
  pour Bottom: 38.09,38.42 38.04,35.41 40.93,35.41 40.94,38.42
  pour Bottom: 36.82,41.62 43.8,41.62 43.8,37.85 36.82,37.85
OLEDCS
  Top 0.406: IC1.57 58.32,39.77 56.18,41.91 OLED.5
PWM1
  Top 0.406: IC1.39 100.32,24.2 105.78,29.65 110.35,29.65 110.79,29.21 PWMOUT.2
PWM2
  Top 0.406: IC1.40 99.85,25 105.4,30.54 110.99,30.54 112.45,29.08 112.45,25.97 111.87,25.4 PWMOUT.4
PWM3
  Top 0.406: IC1.41 99.38,25.8 105.02,31.43 111.43,31.43 113.33,29.53 113.33,23.81 112.38,22.86 PWMOUT.6
RST  (via drill 0.43)
  Top 0.406: IC1.20 55.11,17.6 55.11,16.41 v54.47,15.78 50.35,15.78 S3.B' 48.25,15.72 | S3.B 48.25,15.72 | R12.2 47.35,16.62 48.25,15.72 | IC3.14 80.99,32.02 82.22,30.8 82.22,27.27 81.55,26.61 68.85,26.61 68.6,26.86 v68.57,26.86
  Bottom 0.406: v54.47,15.78 55.12,16.43 55.12,21.68 60.29,26.86 v68.57,26.86
RSTOLED
  Top 0.406: IC1.58 57.52,39.3 53.64,43.18 OLED.4
RXD  (via drill 0.43)
  Top 0.406: ESPPROG.1 96.94,42.02 IC3.8 93.45,42.02 v92.38,40.96 | IC1.27 60.72,19.65 v61.26,20.19
  Bottom 0.406: v92.38,40.96 91.11,40.96 90.54,40.39 75.17,40.39 71.42,36.64 71.42,22.48 69.14,20.19 v61.26,20.19
SCK  (via drill 0.43)
  Top 0.406: IC1.11 52.85,23.4 54.53,25.08 v54.53,30.45
  Bottom 0.406: OLED.2 48.56,43.34 53.8,38.1 53.8,31.27 54.53,30.54 v54.53,30.45
SCL  (via drill 0.43)
  Top 0.406: IC1.25 59.12,15.98 60.95,14.16 v66.22,14.16 | v97.59,20.32 97.59,16.38 94.54,13.34 IC2.16 90.25,13.34 89.78,13.81 R5.1
  Bottom 0.406: TMP.2 106.43,34.56 104.89,33.02 104.89,25.84 99.36,20.32 v97.59,20.32 73.2,20.32 67.04,14.16 v66.22,14.16
SDA  (via drill 0.43)
  Top 0.406: IC1.26 59.92,16.33 61.01,15.24 v64.76,15.24 | v98.79,21.53 98.79,16 94.86,12.07 IC2.15 87.78,12.07 86,13.84 86,15.85 R6.1
  Bottom 0.406: TMP.3 106.65,36.56 103.49,33.4 103.49,26.23 v98.79,21.53 98.73,21.46 72.82,21.46 66.6,15.24 v64.76,15.24
SDCS
  Top 0.406: OLED.6 58.72,40.58 59.11,40.2 59.11,33.22 IC1.56
TXD  (via drill 0.43)
  Top 0.406: ESPPROG.2 97.48,40.02 IC3.7 93.35,40.02 v92.38,39.05 | IC1.28 61.52,18.87 61.9,19.24 v62.53,19.24
  Bottom 0.406: v62.53,19.24 69.39,19.24 72.38,22.23 72.38,35.94 76,39.56 90.6,39.56 91.11,39.05 v92.38,39.05
VBUS  (via drill 0.43)
  Top 0.406: IC1.8 53.09,25.8 v53.33,26.04 | v19.93,28.19 21.13,26.99 38.28,26.99 v41.77,30.48
  Bottom 0.406: v53.33,26.04 53.33,28.89 50.15,32.07 47.61,32.07 | 47.61,32.07 43.36,32.07 v41.77,30.48 | C8.1 47.61,32.22 47.61,32.07
  Bottom 0.61: F1.2 v19.93,28.19
  Bottom 1.016: D1.A 18.28,30.59 F1.2
VREGIN
  Bottom 0.61: C14.1
  Bottom 1.016: 27.21,32.01 IC4.2 27.22,32.01 C14.1 19.68,32.01 D1.C 15.87,35.83 14.91,35.83 | VIN.1 14.91,35.83 | C13.+ 14.91,35.83
  pour Bottom: 13.83,36.14 14.9,37.66 15.98,36.14
XTAL_N
  Top 0.305: IC1.23 57.52,13.43 58.39,12.56 58.39,10.53 arc-90 58.02,10.16 57.27,10.16 arc90 56.87,9.76 X1.3 | X1.3 arc90 X1.3 | X1.3 arc90 X1.3 | X1.3 arc90 X1.3
  Top 0.406: C1.1 X1.3
  Top 0.61: X1.3
XTAL_P
  Top 0.305: C2.1 | IC1.24 58.32,13.57 59.05,12.84 59.05,10.53 arc90 59.42,10.16 60.18,10.16 arc90 60.58,10.56 X1.1 arc90 X1.1 arc-90 X1.1
  Top 0.406: 63.16,11.26 C2.1 X1.1
  Top 0.61: X1.1

### Text on the board
tNames: RX | TX | GND | Jonathan Snyder | 2015
bNames: Rev 2